# EasyEDA Pro project PCB-WearableGasDetect.epro, schematic Schematic7
Create Date: 2025-05-01; Page Name: P1; Project Name: 25大创; Schematic Name: Schematic7; Update Date: 2025-05-01; Company: 嘉立创EDA; Page Size: A4; Version: V1.0
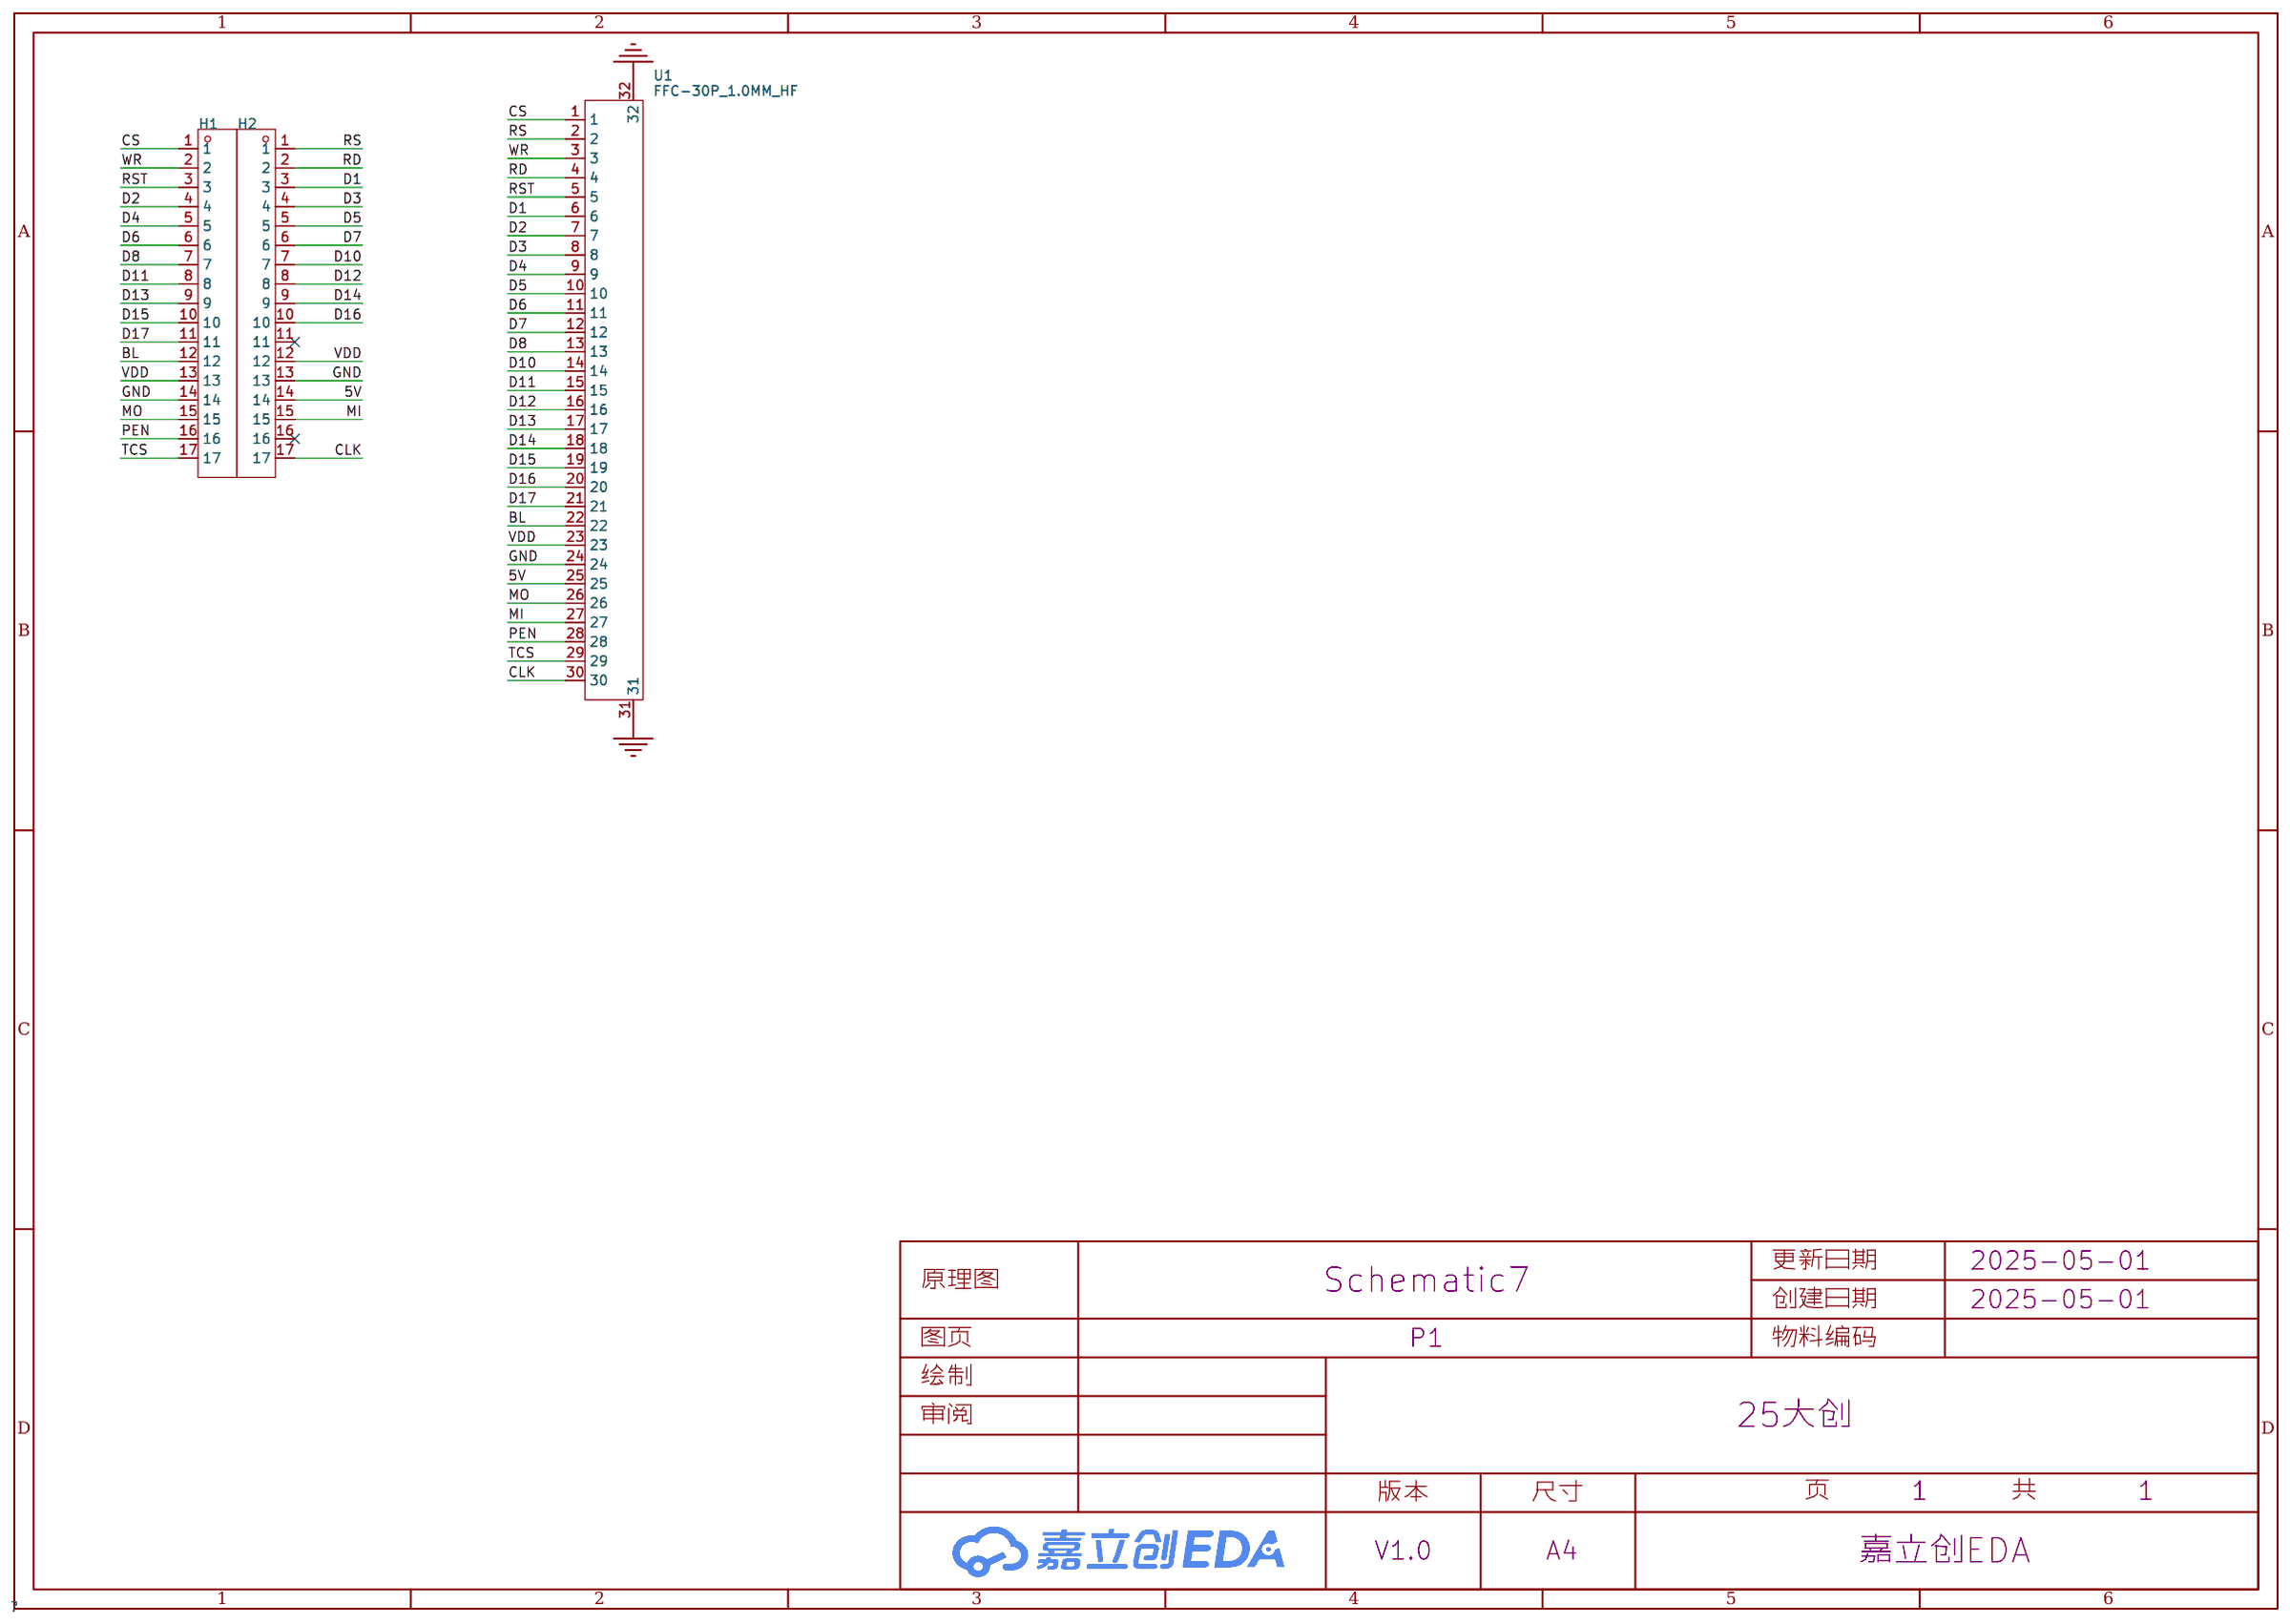
[diagram p5: schematic sheet]

## Parts
H1  -  [HDR-TH_17P-P2.54-V-F]
H2  -  [HDR-TH_17P-P2.54-V-F]
U1  FFC-30P_1.0MM_HF  [FPC-SMD_30P-P1.00_C9900049190]

## Library data of the parts
H1 H2 = HDR-F_2.54_1x17P: Supplier Part: C2897380; Supplier Footprint: 插件
U1 = FFC-30P_1.0MM_HF: Supplier Part: C9900049190; Supplier Footprint: SMD-30P; JLCPCB Part Class: 扩展库; Supplier: LCSC

## Nets
5V: H2.14 U1.25
GND: H1.14 H2.13 U1.24 U1.31 U1.32
VDD: H1.13 H2.12 U1.23
BL: H1.12 U1.22
CLK: H2.17 U1.30
CS: H1.1 U1.1
D1: H2.3 U1.6
D2: H1.4 U1.7
D3: H2.4 U1.8
D4: H1.5 U1.9
D5: H2.5 U1.10
D6: H1.6 U1.11
D7: H2.6 U1.12
D8: H1.7 U1.13
D10: H2.7 U1.14
D11: H1.8 U1.15
D12: H2.8 U1.16
D13: H1.9 U1.17
D14: H2.9 U1.18
D15: H1.10 U1.19
D16: H2.10 U1.20
D17: H1.11 U1.21
MI: H2.15 U1.27
MO: H1.15 U1.26
PEN: H1.16 U1.28
RD: H2.2 U1.4
RS: H2.1 U1.2
RST: H1.3 U1.5
TCS: H1.17 U1.29
WR: H1.2 U1.3

Not connected (* = marked no-connect by the designer): H2 11* 16*
